# EAGLE design Tiefenentladeschutz (EAGLE 8.2.1)
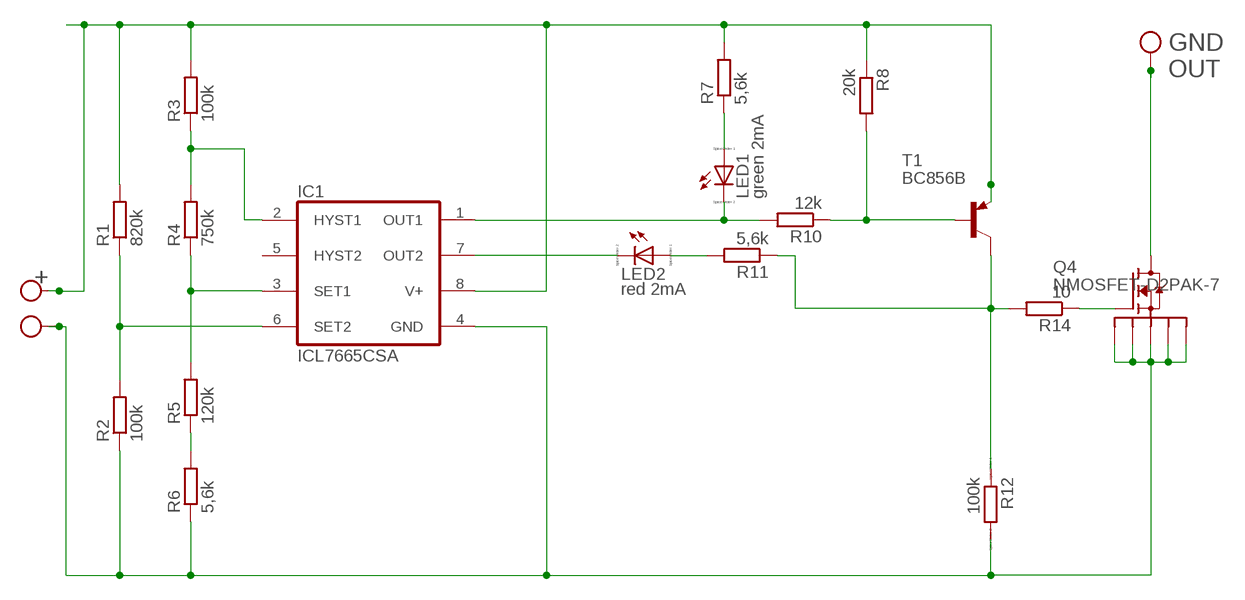
[diagram p0: schematic, sheet 1]

## Parts
IC1  ICL7665CSA  [SO08]
LED1  green 2mA  LED_ESML0603  [LED_SML0603]
LED2  red 2mA  LED_ESML0603  [LED_SML0603]
Q4  NMOSFET-D2PAK-7  [H2PAK-6]
R1  820k  R-EU_R0603  [R0603]
R2  100k  R-EU_R0603  [R0603]
R3  100k  R-EU_M1206  [M1206]
R4  750k  R-EU_R0603  [R0603]
R5  120k  R-EU_R0603  [R0603]
R6  5,6k  R-EU_R0603  [R0603]
R7  5,6k  R-EU_R0603  [R0603]
R8  20k  R-EU_R0603  [R0603]
R10  12k  R-EU_R0603  [R0603]
R11  5,6k  R-EU_R0603  [R0603]
R12  100k  RR1206  [R1206]
R14  10  R-EU_R0603  [R0603]
T1  BC856B  BC856B-PNP-SOT23-BEC  [SOT23-BEC]
U$4  PIN2.54  [PIN]
U$6  PIN1.27  [PIN-1.27]
U$7  PIN1.27  [PIN-1.27]

## Nets
GND: IC1.4(GND) Q4.S1 Q4.S2 Q4.S3 Q4.S4 Q4.S5 R2.1 R6.1 R12.2 U$6.P$1
N$1: Q4.D U$7.P$1
N$2: IC1.3(SET1) R4.1 R5.2
N$3: IC1.7(OUT2) LED2.C
N$4: IC1.6(SET2) R1.1 R2.2
N$5: LED2.A R11.2
N$6: LED1.A R7.1
N$7: R8.2 R10.1 T1.B
N$12: Q4.G R14.1
N$13: IC1.2(HYST1) R3.1 R4.2
N$16: IC1.1(OUT1) LED1.C R10.2
N$22: R11.1 R12.1 R14.2 T1.C
N$26: R5.1 R6.2
V+: IC1.8(V+) R1.2 R3.2 R7.2 R8.1 T1.E U$4.P$1
Unconnected: IC1.5(HYST2)

## Notes on the sheet
- GND 
  OUT
- +

## Library data of the parts
IC1 = maxim:ICL7665CSA: UNDER/OVER VOLTAGE DETECTOR; MPN: ICL7665CSA+; OC_FARNELL: unknown; OC_NEWARK: 19M9537
LED1 LED2 = eagle-ltspice:LED_E: LED Source: http://www.osram.convergy.de Source: www.luxeon.com Source: www.kingbright.com; SPICEMODEL: NONE; SPICEPREFIX: D; SPICETYPE: diode
Q4 = D2pak-7:NMOSFET-D2PAK-7
R1 R2 = resistor:R-EU_: RESISTOR, European symbol
R3-R8 R10 R11 R14 = rcl:R-EU_: RESISTOR, European symbol
R12 = eagle-ltspice:R: RESISTOR, European symbol; SPICEMODEL: NONE; SPICEPREFIX: R
T1 = transistor:*-PNP-: PNP Transistror
U$4 U$6 U$7 = 0liver:PIN

## Board
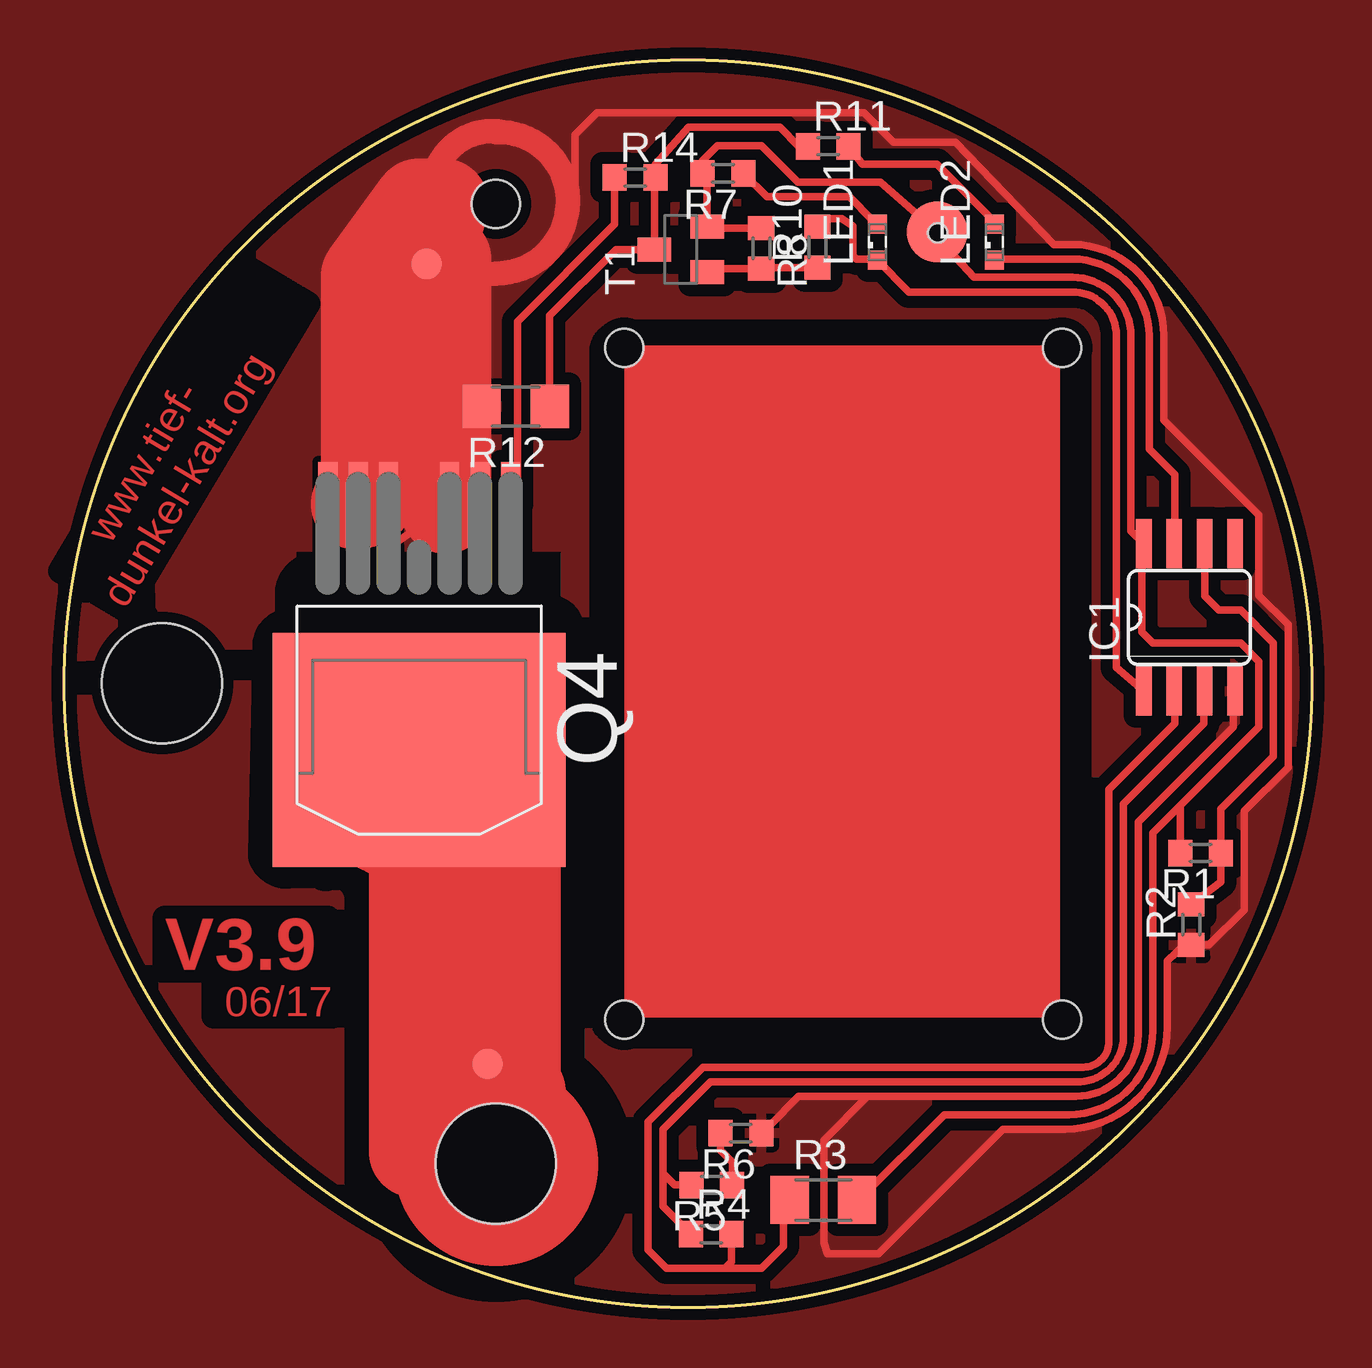
[diagram p1: board, top side]

Size 52 x 52 mm. Coordinates in mm from the lower left corner, seen from the top.
Outline: circle at 26,26 radius 26
Copper layers (1*16): Top 0.035mm / dielectric 1.5mm / Bottom 0.035mm
Design rules "default *": minimum track width 14mil, minimum drill 24mil, track to track 20mil, track to pad 20mil, pad to pad 20mil, via to via 20mil, smd to smd 8mil, copper to edge 18mil, drill to drill 18mil, minimum pad ring 10mil, minimum via ring 8mil, stop-mask expansion 4mil, vias tented up to drill 0mil, thermal gap 10mil
Holes 2 mm at 18,46
Holes 5 mm at 18,6 4.08,26.02
Holes 1.6 mm at 23.35,40 41.6,40 41.6,12 23.35,12
Holes 0.8 mm at 36.4,44.8
tRestrict: area 22.1,11 to 42.6,41; area 13,1 to 23,11; area 9.7,26.6 to 20.7,31.5; 17 lines

### Footprints (pad centres in the part's own frame; a part is rotated, then mirrored left to right if it is on the bottom)
SO08 = smd 0.66 x 2.032: 1 -1.905,-3.073; 2 -0.635,-3.073; 3 0.635,-3.073; 4 1.905,-3.073; 5 1.905,3.073; 6 0.635,3.073; 7 -0.635,3.073; 8 -1.905,3.073
LED_SML0603 = smd 0.8 x 0.8: A 0.75,0; C -0.75,0
H2PAK-6 = smd 12.2 x 9.75: D 0,1.56 | smd 0.8 x 3.5: G -3.81,-8.7; S1 -2.54,-8.7; S2 -1.27,-8.7; S3 1.27,-8.7; S4 2.54,-8.7; S5 3.81,-8.7
R0603 = smd 1 x 1.1: 1 -0.85,0; 2 0.85,0
M1206 = smd 1.6 x 2: 1 -1.4,0; 2 1.4,0
R1206 = smd 1.6 x 1.803: 1 -1.422,0; 2 1.422,0
SOT23-BEC = smd 1 x 1.4: B -0.95,-1.1; C 0,1.1; E 0.95,-1.1
PIN = smd 2.54 x 2.54: P$1 0,0
PIN-1.27 = smd 1.27 x 1.27: P$1 0,0

### Placement (x,y rotation side)
IC1  46.9,28.77 0 top
LED1  33.9,44.41 90 top
LED2  38.77,44.41 90 top
Q4  14.8,24.8 180 top
R1  47.37,18.94 180 top
R2  46.98,15.95 90 top
R3  31.65,4.48 0 top
R4  26.97,3.06 0 top
R5  26.99,5.11 180 top
R6  28.21,7.27 180 top
R7  27.46,47.27 180 top
R8  29.06,44.15 270 top
R10  31.4,44.2 90 top
R11  31.85,48.4 0 top
R12  18.82,37.56 180 top
R14  23.8,47.1 0 top
T1  25.7,44.1 90 top
U$1  PIN-GENERIC  [LEER]  -3.5,-3.5 0 top  (outside the outline)
U$4  36.38,44.84 0 top
U$5  PIN-GENERIC  [LEER]  -3.5,-3.5 0 top  (outside the outline)
U$6  15.1,43.5 0 top
U$7  17.65,10.15 0 top

### Tracks (layer width: path | path; a pad name or v marks a point on that pad's centre or on a via)
FILL
  pour Top: -7,58.3 59.64,58.05 59.64,-6.66 -7,-6
GND
  Top 0.305: 15.9,33.33 13.27,31.5 | U$6.P$1 14.1,42.5 14.1,42 16.3,38.9 R12.2 | Q4.S5 12.2,33.5 Q4.S4 13.3,33.5 13.4,33.4 15.97,33.4 Q4.S2 16.1,33.5 16.2,33.4 17.24,33.4 Q4.S1 | IC1.4 48.73,25.62 48.73,24.19 44.77,20.23 44.77,11.39 arc-90 42.18,8.8 33.49,8.8 | R6.1 29.4,7.58 30.62,8.8 33.49,8.8 | 21,46.2 21.3,46.5 21.3,48.88 22.21,49.8 33.34,49.8 34.56,48.58 37.15,48.58 41.26,44.31 42.02,44.31 arc-90 45.84,40.5 45.84,37 49.8,33.03 49.8,29.68 51.02,28.46 51.02,22.52 49.19,20.69 49.19,16.57 47.72,15.1 R2.1 46.75,15.18 45.99,14.44 45.99,11.7 arc-90 41.72,7.43 39.13,7.43 33.95,2.25 31.81,2.25 31.66,2.71 31.66,6.97 33.49,8.8
  Top 0.406: Q4.S4 Q4.S3
  Top 0.61: 12.14,33.3 11.9,33.26
  Top 1.016: 15.8,46 15.4,47 arc-90 18.3,49 18,49 arc-90 21,46.2 21,46.1 arc-90 18,43.1 arc118 12.14,33.3
  Top 3.81: 15.9,33.33 15.9,43.7 U$6.P$1 15.8,46 14.8,46 12.6,43 12.6,33.6 12.2,33.5
  pour Top: -7,58 -7,-6 60,-6.4 59.5,58
N$1
  Top 0.305: U$7.P$1 15.5,8 14.6,7 | 14.6,6.5 14.6,23.04 Q4.D
  Top 3.81: 18.8,19 18.8,8.3 19,9 17,9 15.7,19.5 15.2,20 13.2,20 14.6,19.2 14.6,7 14.6,6.5
  pour Top (no thermals): 18.95,17 arc90 20.45,18.5
N$2
  Top 0.305: IC1.3 47.51,25.67 47.51,24.35 44.16,20.99 44.16,11.24 arc-90 42.18,9.41 26.94,9.41 24.96,7.43 24.96,5.6 | 24.96,5.6 24.96,4.22 R4.1 | R5.2 25.45,5.11 24.96,5.6
N$3
  Top 0.305: IC1.7 46.29,31.26 46.29,34.71 45.23,35.78 45.23,40.5 arc90 42.02,43.7 38.98,43.7 38.82,43.67 LED2.C
N$4
  Top 0.305: 47.51,31.87 IC1.6 47.54,29.66 48.12,29.07 49.03,29.07 50.41,27.7 50.41,22.98 48.22,20.79 R1.1 48.22,17.74 R2.2
N$5
  Top 0.305: R11.2 33.28,47.66 36.39,47.66 38.93,45.12 LED2.A
N$6
  Top 0.305: R7.1 29.29,46.29 32.73,46.29 33.69,45.33 LED1.A
N$7
  Top 0.305: T1.B 26.95,43.3 R8.2 29.11,43.35 R10.1
N$12
  Top 0.305: Q4.G 18.9,33.5 18.9,41.1 22.95,45.15 R14.1
N$13
  Top 0.305: IC1.2 46.29,25.67 46.29,24.35 43.55,21.6 43.55,11.09 arc-90 42.48,10.02 26.63,10.02 24.35,7.73 24.35,2.4 25.11,1.64 27.55,1.64 | 27.55,1.64 29.07,1.64 29.98,2.55 29.98,4.43 R3.1 | R4.2 27.82,1.91 27.55,1.64
N$14
  pour Top (no thermals): 15.92,34.46 17.48,34.46 17.48,32.05 15.92,32.05
N$16
  Top 0.305: R10.2 31.73,45.38 32.42,45.38 32.88,45.07 32.88,43.85 33.03,43.7 33.53,43.7 LED1.C 35.2,42.33 42.18,42.33 arc-90 43.85,40.35 43.85,26.68 IC1.1
N$22
  Top 0.305: 20.2,37.52 R12.1 | 20.3,37 20.3,37.5 R12.1 | R12.1 20.24,41.34 23,44.1 T1.C | T1.C 24.6,47.05 R14.2 24.65,47.66 26.02,49.19 29.83,49.19 30.62,48.4 R11.1 | T1.C 24.65,44.05
N$26
  Top 0.305: R6.2 27.36,6.55 27.85,6.06 27.85,5.12 R5.1
V+
  Top 0.305: 29.01,45.05 R8.1 26.85,45 T1.E | 26.57,44.97 T1.E | 46.67,21.07 49.8,24.19 49.8,26.94 49.03,27.7 45.38,27.7 44.92,28.16 44.92,31.15 IC1.8 44.46,32.37 44.46,40.5 arc90 42.02,42.94 37.91,42.94 36.16,44.84 U$4.P$1 34.02,46.9 30.59,46.9 29.07,48.43 27.24,48.43 26.61,47.79 R7.2 26.8,47.08 T1.E | 46.67,21.07 45.38,19.77 45.38,11.54 arc-90 41.87,8.04 36.69,8.04 33.13,4.48 R3.2 | T1.E 26.61,45.05 | R1.2 46.52,20.92 46.67,21.07
(copper drawn outside any net)
  shapes: Top area x1, Top circle x1

### Text on the board
Top: Tiefenentladeschutz V3.9 06/2017 | Mosfet STH270N4F3-6 | www.tief- / dunkel-kalt.org | V3.9 | 06/17 | 11/15